# EAGLE design piezo_flasher_v2.0 (EAGLE 9.0.0)
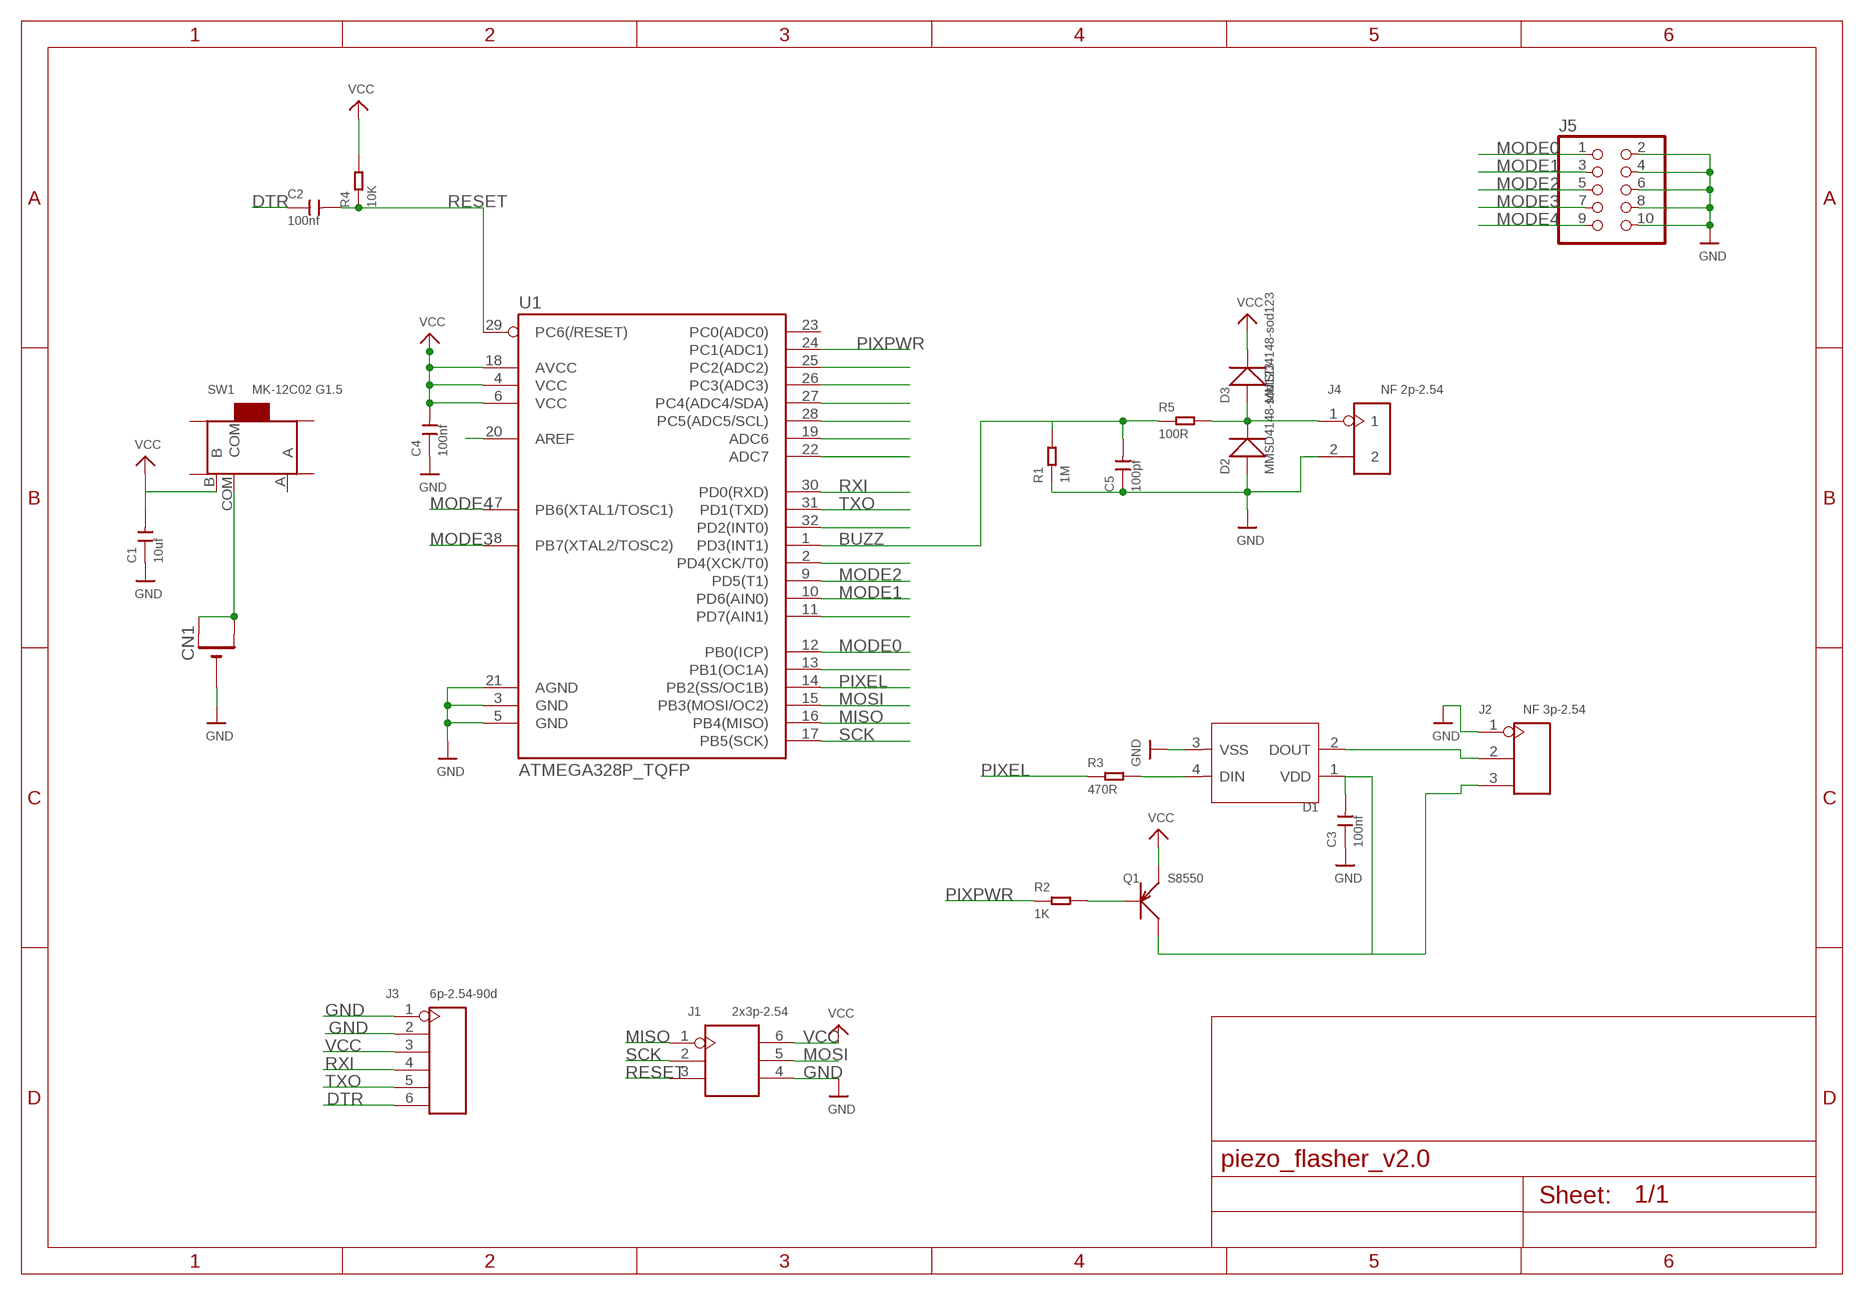
[diagram p0: schematic, sheet 1]

## Parts
C1  10uf  CERAMIC-10UF-25V-10%-X5R(0805)  [C0805]
C2  100nf  CERAMIC-100NF-50V-10%-X7R(0805)  [C0805]
C3  100nf  CERAMIC-100NF-50V-10%-X7R(0805)  [C0805]
C4  100nf  CERAMIC-100NF-50V-10%-X7R(0805)  [C0805]
C5  100pf  CERAMIC-100PF-50V-5%-NPO(0603)  [C0603]
CN1  CR2032SMT  [CR2032-SMD]
D1  SMD-RGB-LED-4P'WS2812B'  [LED4-SMD-5050]
D2  MMSD4148-sod123  SMD-DIODE-100V-200MA(SOD-123)  [SOD-123]
D3  MMSD4148-sod123  SMD-DIODE-100V-200MA(SOD-123)  [SOD-123]
J1  2x3p-2.54  DIP-BLACK-MALE-HEADER(2X3P-2.54）-2.54  [H2X3-2.54]
J2  NF 3p-2.54  DIP-BLACK-MALE-HEADER-VERT(3P-2.54)  [H3-2.54]
J3  6p-2.54-90d  DIP-BLACK-SHORT-MALE-HEADER-R/A(6P-2.54-90D)  [H6-2.54-90D-MALE]
J4  NF 2p-2.54  DIP-BLACK-MALE-HEADER-VERT(2P-2.54)  [H2-2.54]
J5  HEADER-2X5  [2X05]
Q1  S8550  SMD-TRANSISTORS-PNP-25V-500MA-S8550(SOT-23)  [SOT-23]
R1  1M  SMD-RES-1M-1%-1/10W(0603)  [R0603]
R2  1K  SMD-RES-1K-5%-1/8W(0805)  [R0805]
R3  470R  SMD-RES-470R-5%-1/10W(0603)  [R0603]
R4  10K  SMD-RES-10K-1%-1/8W(0805)  [R0805]
R5  100R  SMD-RES-100R-5%-1/8W(0805)  [R0805]
SW1  MK-12C02 G1.5  SMD-TOGGLE-SWITCH-ON-ON(3+4P-6.7X2.7MM)  [SW7-SMD-L6.7X2.7X3.2MM]
U1  ATMEGA328P_TQFP  [TQFP32-08]

## Nets
BUZZ: C5.2 R1.2 R5.1 U1.1(PD3(INT1))
DTR: C2.1 J3.6
GND: C1.1 C3.1 C4.1 C5.1 CN1.- D1.3(VSS) D2.+ J1.4 J2.1 J3.1 J3.2 J4.2 J5.2 J5.4 J5.6 J5.8 J5.10 R1.1 U1.3(GND) U1.5(GND) U1.21(AGND)
MISO: J1.1 U1.16(PB4(MISO))
MODE0: J5.1 U1.12(PB0(ICP))
MODE1: J5.3 U1.10(PD6(AIN0))
MODE2: J5.5 U1.9(PD5(T1))
MODE3: J5.7 U1.8(PB7(XTAL2/TOSC2))
MODE4: J5.9 U1.7(PB6(XTAL1/TOSC1))
MOSI: J1.5 U1.15(PB3(MOSI/OC2))
N$1: Q1.1(B) R2.2
N$3: D1.4(DIN) R3.2
N$4: D2.- D3.+ J4.1 R5.2
N$5: D1.2(DOUT) J2.2
N$6: C3.2 D1.1(VDD) J2.3 Q1.3(C)
N$7: CN1.+$1(+) CN1.+$2(+1) SW1.COM
N$8: U1.13(PB1(OC1A))
N$10: U1.25(PC2(ADC2))
N$11: U1.26(PC3(ADC3))
N$15: U1.27(PC4(ADC4/SDA))
N$19: U1.28(PC5(ADC5/SCL))
N$20: U1.19(ADC6)
N$21: U1.22(ADC7)
N$22: U1.32(PD2(INT0))
N$23: U1.2(PD4(XCK/T0))
N$26: U1.11(PD7(AIN1))
N$32: U1.20(AREF)
PIXEL: R3.1 U1.14(PB2(SS/OC1B))
PIXPWR: R2.1 U1.24(PC1(ADC1))
RESET: C2.2 J1.3 R4.1 U1.29(PC6(/RESET))
RXI: J3.4 U1.30(PD0(RXD))
SCK: J1.2 U1.17(PB5(SCK))
TXO: J3.5 U1.31(PD1(TXD))
VCC: C1.2 C4.2 D3.- J1.6 J3.3 Q1.2(E) R4.2 SW1.B U1.4(VCC) U1.6(VCC) U1.18(AVCC)
Unconnected: SW1.A SW1.SS1 SW1.SS2 SW1.SS3 SW1.SS4 U1.23(PC0(ADC0))

## Library data of the parts
C1 = Seeed-Capacitor:CERAMIC-10UF-25V-10%-X5R(0805): 302010178; MPN: CC0805KKX5R8BB106
C2-C4 = Seeed-Capacitor:CERAMIC-100NF-50V-10%-X7R(0805): 302010165; MPN: CC0805KRX7R9BB104
C5 = Seeed-Capacitor:CERAMIC-100PF-50V-5%-NPO(0603): 302010076; MPN: CC0603JRNPO9BN101
CN1 = adafruit:CR2032
D1 = Seeed-Diode:SMD-RGB-LED-4P: 304990003
D2 D3 = Seeed-Diode:SMD-DIODE-100V-200MA(SOD-123): 304010007; MPN: MMSD4148
J1 = Seeed-Connector:DIP-BLACK-MALE-HEADER(2X3P-2.54）: 320020077; MPN: P125-12A1BS116A1
J2 = Seeed-Connector:DIP-BLACK-MALE-HEADER-VERT(3P-2.54): 320020079; VALUE: 3p-2.54
J3 = Seeed-Connector:DIP-BLACK-SHORT-MALE-HEADER-R/A(6P-2.54-90D): 320020019
J4 = Seeed-Connector:DIP-BLACK-MALE-HEADER-VERT(2P-2.54): 320020016; MPN: P125-1102A0BS116A1; VALUE: 2p-2.54
J5 = microbuilder:HEADER-2X5: PIN HEADER
Q1 = Seeed-Transistor:SMD-TRANSISTORS-PNP-25V-500MA-S8550(SOT-23): 305020006; MPN: S8550
R1 = Seeed-Resistor:SMD-RES-1M-1%-1/10W(0603): 301010151; MPN: RC0603FR-071ML
R2 = Seeed-Resistor:SMD-RES-1K-5%-1/8W(0805): 301010311; MPN: RC0805JR-071KL
R3 = Seeed-Resistor:SMD-RES-470R-5%-1/10W(0603): 301010088; MPN: RC0603JR-07470RL
R4 = Seeed-Resistor:SMD-RES-10K-1%-1/8W(0805): 301010361; MPN: RC0805FR-0710KL
R5 = Seeed-Resistor:SMD-RES-100R-5%-1/8W(0805): 301010319; MPN: RC0805JR-07100RL
SW1 = Seeed-Switch:SMD-TOGGLE-SWITCH-ON-ON(3+4P-6.7X2.7MM): 311030001; MPN: MK-12C02 G1.5
U1 = SparkFun-DigitalIC:ATMEGA328P_TQFP; PROD_ID: IC-09069

## Board
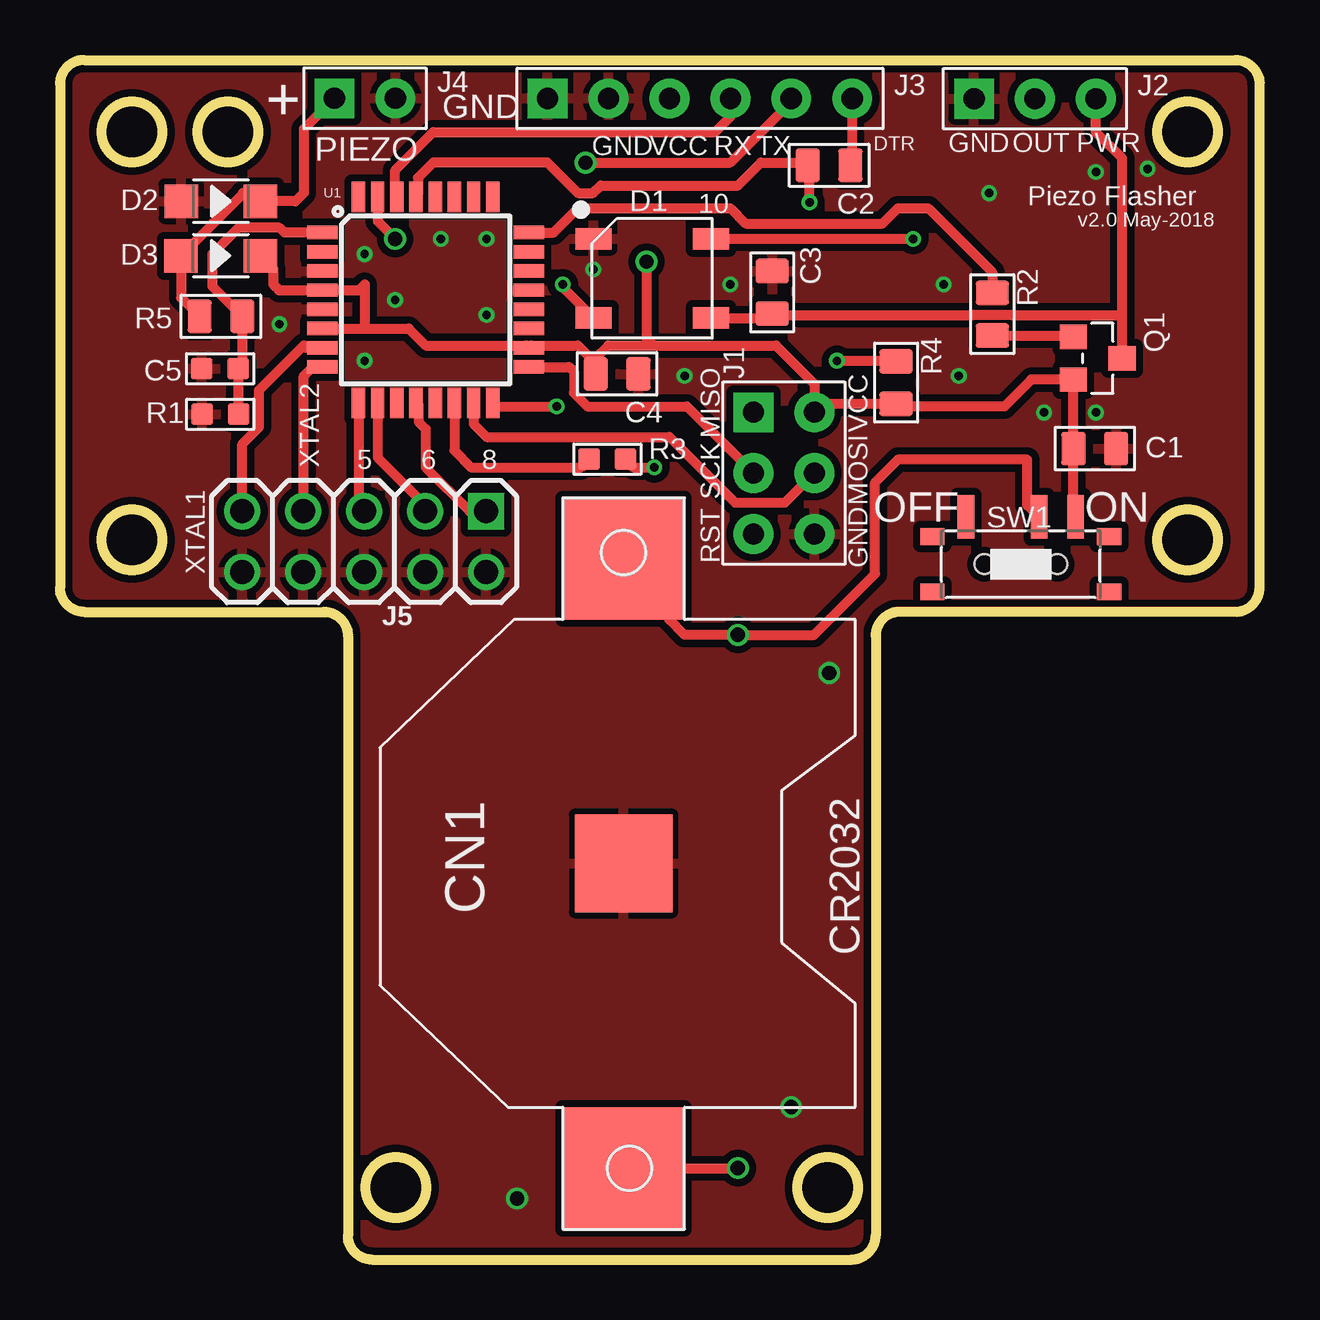
[diagram p1: board, top side]
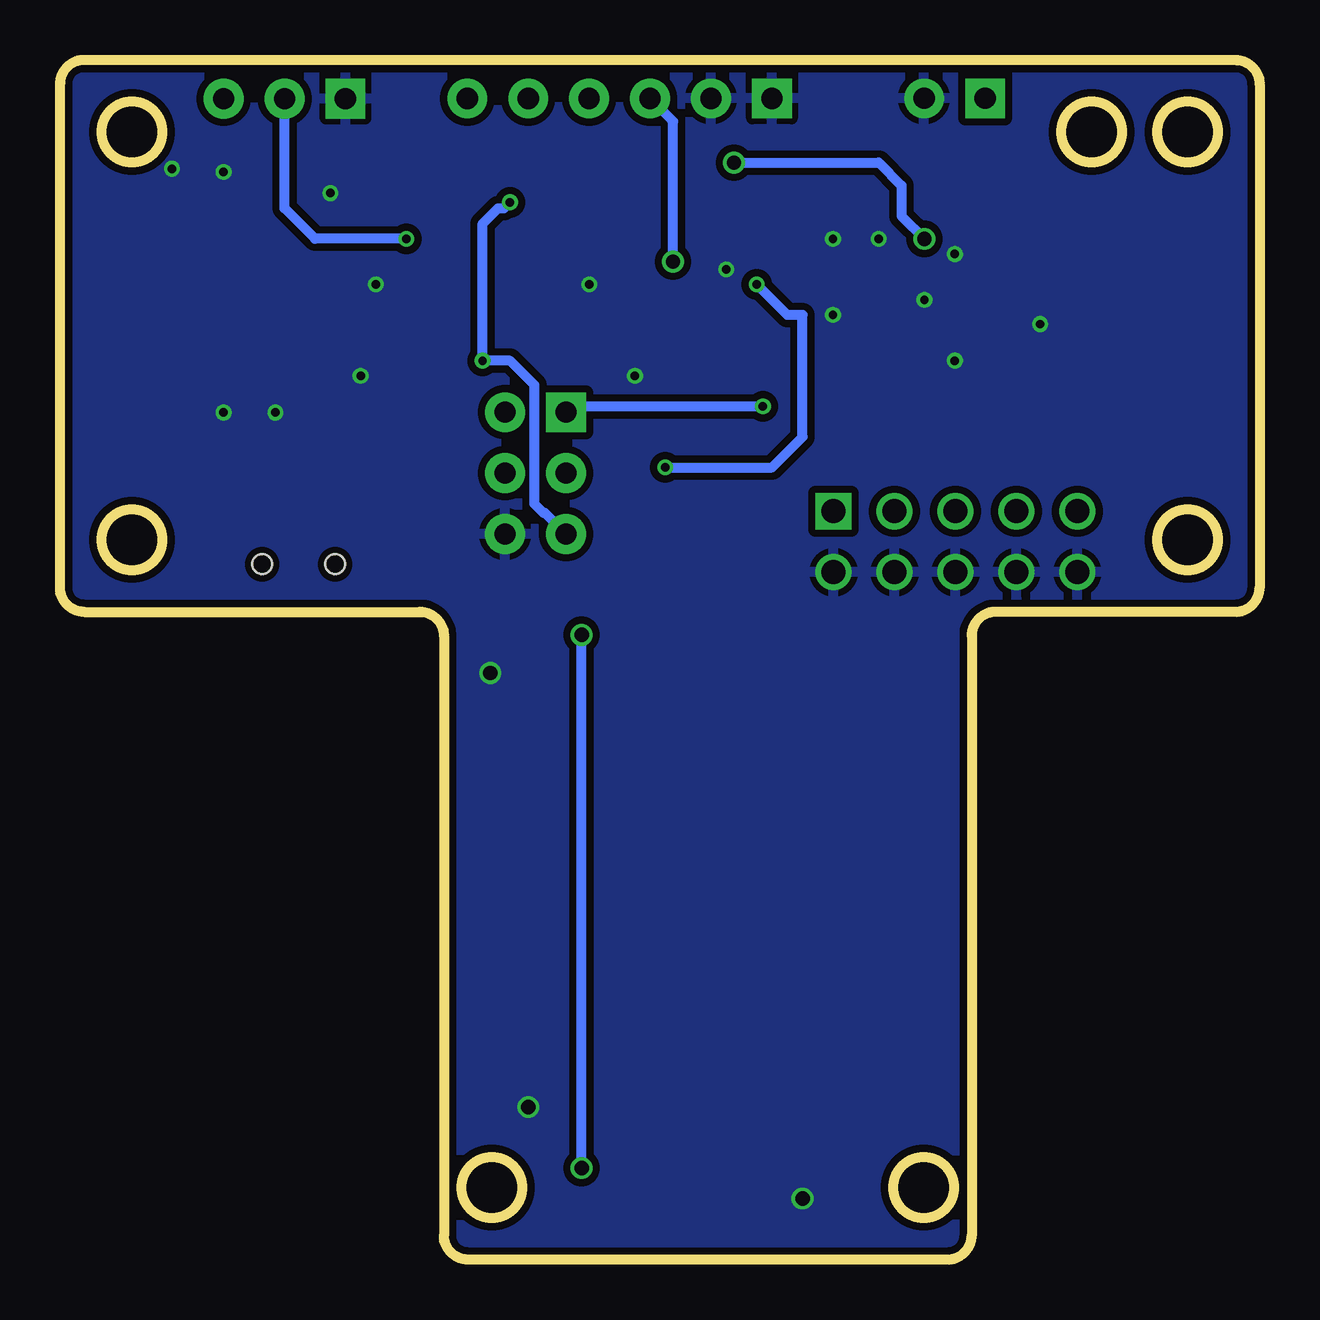
[diagram p2: board, bottom side, seen from below]

Size 50 x 50 mm. Coordinates in mm from the lower left corner, seen from the top.
Outline: 13,0 33,0 arc90 34,1 34,26 arc-90 35,27 49,27 arc90 50,28 50,49 arc90 49,50 1,50 arc90 0,49 0,28 arc90 1,27 11,27 arc-90 12,26 12,1 arc90 13,0
Outline: circle at 14,3 radius 1.27
Outline: circle at 32,3 radius 1.27
Outline: circle at 47,30 radius 1.27
Outline: circle at 47,47 radius 1.27
Outline: circle at 3,47 radius 1.27
Outline: circle at 3,30 radius 1.27
Outline: circle at 7,47 radius 1.27
Copper layers (1*16): Top 0.035mm / dielectric 1.5mm / Bottom 0.035mm
Design rules "SeeedStudio_2layer_DRU_no_angle_20140221": minimum track width 6mil, minimum drill 12mil, track to track 6mil, track to pad 6mil, pad to pad 6mil, via to via 6mil, smd to smd 0mil, copper to edge 10mil, drill to drill 10mil, minimum pad ring 10mil, minimum via ring 6mil, stop-mask expansion 2mil, vias tented up to drill 100mil, thermal gap 10mil

### Footprints (pad centres in the part's own frame; a part is rotated, then mirrored left to right if it is on the bottom)
C0805 = smd 1.397 x 1.016: 1 0,0.889; 2 0,-0.889
C0603 = smd 0.889 x 0.889: 1 0,0.762; 2 0,-0.762
CR2032-SMD = smd 5.08 x 5.08: +$1 -12.7,0; +$2 12.7,0 | smd 4.064 x 4.064: - 0,0
LED4-SMD-5050 = smd 1.5 x 0.9: 1 -2.45,1.65; 2 -2.45,-1.65; 3 2.45,-1.65; 4 2.45,1.65
SOD-123 = smd 1.397 x 1.397: + -1.651,0; - 1.651,0
H2X3-2.54 = drill 0.889 pad 1.651 square: 1 -1.27,2.54 | drill 0.889 pad 1.651: 2 -1.27,0; 3 -1.27,-2.54; 4 1.27,-2.54; 5 1.27,0; 6 1.27,2.54
H3-2.54 = drill 0.889 pad 1.651 square: 1 0,2.54 | drill 0.889 pad 1.651: 2 0,0; 3 0,-2.54
H6-2.54-90D-MALE = drill 0.889 pad 1.651 square: 1 0,6.35 | drill 0.889 pad 1.651: 2 0,3.81; 3 0,1.27; 4 0,-1.27; 5 0,-3.81; 6 0,-6.35
H2-2.54 = drill 0.889 pad 1.651 square: 1 0,1.27 | drill 0.889 pad 1.651: 2 0,-1.27
2X05 = drill 1 square: 1 -5.08,-1.27 | drill 1: 2 -5.08,1.27; 3 -2.54,-1.27; 4 -2.54,1.27; 5 0,-1.27; 6 0,1.27; 7 2.54,-1.27; 8 2.54,1.27; 9 5.08,-1.27; 10 5.08,1.27
SOT-23 = smd 1.016 x 1.143: 1 -0.889,-1.016; 2 0.889,-1.016; 3 0,1.016
R0603 = smd 0.889 x 0.889: 1 0,0.762; 2 0,-0.762
R0805 = smd 1.397 x 1.016: 1 0,0.889; 2 0,-0.889
SW7-SMD-L6.7X2.7X3.2MM = smd 1.8 x 0.7: A 1.978,2.286; B 1.978,-2.286; COM 1.978,-0.762 | smd 0.7 x 1.016: SS1 -1.15,-3.683; SS2 1.15,-3.683; SS3 1.15,3.683; SS4 -1.15,3.683 | hole 0.813: 0,-1.524; 0,1.524
TQFP32-08 = smd 1.27 x 0.559: 1 -4.293,2.8; 2 -4.293,2; 3 -4.293,1.2; 4 -4.293,0.4; 5 -4.293,-0.4; 6 -4.293,-1.2; 7 -4.293,-2; 8 -4.293,-2.8; 17 4.293,-2.8; 18 4.293,-2; 19 4.293,-1.2; 20 4.293,-0.4; 21 4.293,0.4; 22 4.293,1.2; 23 4.293,2; 24 4.293,2.8 | smd 0.559 x 1.27: 9 -2.8,-4.293; 10 -2,-4.293; 11 -1.2,-4.293; 12 -0.4,-4.293; 13 0.4,-4.293; 14 1.2,-4.293; 15 2,-4.293; 16 2.8,-4.293; 25 2.8,4.293; 26 2,4.293; 27 1.2,4.293; 28 0.4,4.293; 29 -0.4,4.293; 30 -1.2,4.293; 31 -2,4.293; 32 -2.8,4.293

### Placement (x,y rotation side)
C1  43.13,33.8 270 top
C2  32.06,45.61 270 top
C3  29.69,40.31 0 top
C4  23.22,36.92 270 top
C5  6.67,37.13 90 top
CN1  23.5,16.51 270 top
D1  24.68,40.9 180 top
D2  6.71,44.11 0 top
D3  6.7,41.84 0 top
J1  30.18,32.78 0 top
J2  40.64,48.38 90 top
J3  26.68,48.4 90 top
J4  12.71,48.4 90 top
J5  12.67,29.92 180 top
Q1  43.26,37.57 270 top
R1  6.68,35.24 90 top
R2  38.86,39.4 0 top
R3  22.82,33.36 90 top
R4  34.85,36.55 0 top
R5  6.71,39.31 270 top
SW1  40.05,28.98 90 top
U1  15.24,40.01 0 top

### Tracks (layer width: path | path; a pad name or v marks a point on that pad's centre or on a via)
BUZZ
  Top 0.406: U1.1 9.36,42.8 9.16,43.01 7.45,43.01 6.35,41.91 6.35,40.56 R5.1 7.6,37.3 C5.2 7.43,35.25 R1.2
DTR
  Top 0.406: C2.1 33.02,45.68 J3.6
GND  (via drill 0.35, 0.6)
  other vias: 19.05,2.54 30.48,6.35 32.07,24.45 9.14,38.99 26.04,36.83 22.23,41.27 12.7,41.91 15.88,42.55 17.78,42.55 17.78,39.37 13.97,40.01 12.7,37.47 41.02,35.31 43.18,35.31 36.83,40.64 38.73,44.45 43.18,45.34 45.34,45.47 27.94,40.64 37.47,36.83
  pour Top (isolate 0.305): 0,50 50,50 50,27 34,27 34,0 12,0 12,27 0,27
  pour Bottom (isolate 0.305): 0,50 50,50 50,27 34,27 34,0 12,0 12,27 0,27
MISO  (via drill 0.35)
  Top 0.406: U1.16 18.19,35.56 v20.7,35.56
  Bottom 0.406: v20.7,35.56 28.67,35.56 J1.1
MODE0
  Top 0.406: U1.12 14.95,35.6 14.95,34.91 15.24,34.62 15.24,33.02 17.07,31.19 J5.1
MODE1
  Top 0.406: U1.10 13.24,33.43 15.21,31.46 J5.3
MODE2
  Top 0.406: J5.5 12.44,31.43 U1.9
MODE3
  Top 0.406: J5.7 10.16,31.22 10.16,36.83 10.54,37.2 U1.8
MODE4
  Top 0.406: J5.9 7.59,33.99 8.3,34.69 8.3,36.24 10.16,38.1 10.26,38.01 U1.7
MOSI
  Top 0.406: U1.15 17.24,34.83 17.78,34.29 25.4,34.29 28.14,31.55 30.21,31.55 J1.5
N$1
  Top 0.406: 42.01,38.23 Q1.1 42.18,38.52 R2.2
N$3  (via drill 0.35)
  Top 0.406: R3.2 23.91,33.02 v24.77,33.02 | v20.95,40.64 20.95,40.53 D1.4
  Bottom 0.406: v24.77,33.02 20.32,33.02 19.05,34.29 19.05,39.37 19.68,39.37 v20.95,40.64
N$4
  Top 0.406: J4.1 10.16,47.12 10.16,44.45 9.82,44.11 D2.- | 6.35,43.14 D3.+ 5.05,40.09 R5.2 | 6.35,43.14 6.35,43.18 | 8.36,43.92 D2.- | D2.- 8.02,44.45 7.62,44.45 7.62,44.41 6.35,43.14
N$5  (via drill 0.35)
  Top 0.406: D1.2 v35.56,42.55
  Bottom 0.406: v35.56,42.55 39.37,42.55 40.64,43.81 40.64,43.82 J2.2
N$6
  Top 0.406: Q1.3 44.27,39.37 | 44.27,39.37 44.27,45.9 43.18,46.99 J2.3 | D1.1 29.51,39.25 C3.2 29.74,39.37 38.08,39.37 38.09,39.38 39.63,39.38 39.65,39.37 44.27,39.37
N$7  (via drill 0.6)
  Top 0.406: CN1.+$1 24.13,29.21 25.4,27.94 25.4,26.67 26.04,26.04 v28.26,26.04 31.43,26.04 33.97,28.57 33.97,32.38 34.92,33.34 40.32,33.34 40.32,31.45 SW1.COM | CN1.+$2 v28.26,3.81
  Bottom 0.406: v28.26,3.81 v28.26,26.04
PIXEL
  Top 0.406: U1.14 16.44,33.73 17.14,33.02 21.72,33.02 R3.1
PIXPWR
  Top 0.406: 19.63,42.8 U1.24 20.58,42.8 21.59,43.81 27.94,43.81 28.57,43.18 34.29,43.18 34.92,43.81 36.2,43.81 38.86,41.15 R2.1
RESET  (via drill 0.35)
  Top 0.406: U1.29 14.92,44.38 14.92,45.09 15.56,45.72 20.32,45.72 21.59,44.45 22.23,44.45 22.54,44.77 28.26,44.77 29.21,45.72 31.06,45.72 C2.2 31.24,45.53 v31.24,44.07 | v32.38,37.47 34.83,37.47 R4.1
  Bottom 0.406: J1.3 29.78,31.11 29.84,31.11 30.23,31.5 30.23,36.45 31.24,37.47 v32.38,37.47 32.38,43.18 31.75,43.81 31.5,43.81 v31.24,44.07
RXI
  Top 0.406: U1.30 13.97,44.37 13.97,45.4 15.56,46.99 27.3,46.99 27.95,47.63 J3.4
SCK
  Top 0.406: U1.17 21.21,37.2 21.42,37 21.42,36.12 21.98,35.56 26.13,35.56 J1.2
TXO  (via drill 0.6)
  Top 0.406: U1.31 13.24,43.27 v13.97,42.55 | J3.5 30.48,48.27 27.94,45.72 v21.91,45.72
  Bottom 0.406: v13.97,42.55 14.92,43.5 14.92,44.77 15.88,45.72 v21.91,45.72
VCC  (via drill 0.6)
  Top 0.406: 10.88,38.73 U1.6 12.7,38.8 | 12.7,38.8 14.54,38.8 15.24,38.1 19.44,38.1 U1.18 19.63,38.1 21.59,38.1 22.33,37.36 C4.2 22.33,37.57 22.86,38.1 24.77,38.1 | D3.- 8.89,41.3 8.89,40.64 9.12,40.41 U1.4 12.46,40.41 12.7,40.64 12.7,38.8 | SW1.B 42.24,31.05 C1.2 Q1.2 40.49,36.68 39.37,35.56 34.95,35.56 R4.2 31.79,35.66 J1.6 | J1.6 31.36,35.32 | v24.45,41.59 24.45,38.42 24.77,38.1 | 24.77,38.1 29.84,38.1 31.45,36.5 J1.6
  Bottom 0.406: v24.45,41.59 24.45,47.44 J3.3

### Text on the board
tPlace: Piezo Flasher | v2.0 May-2018 | OFF | ON | CR2032
tNames: GND | + | PIEZO | GND | VCC | RX | TX | DTR | GND | OUT | PWR | 10 | MISO | VCC | XTAL2 | 5 | 6 | 8 | SCK | MOSI | XTAL1 | RST | GND
200bmp: /Users/shunya/Documents/FrriteKun/dojo_logo_bw2.bmp
225bmp: /Users/shunya/Documents/FrriteKun/dojo_logo_bw4.bmp